# Altium schematic sheet NPNTransistorArray.SchDoc
size A3
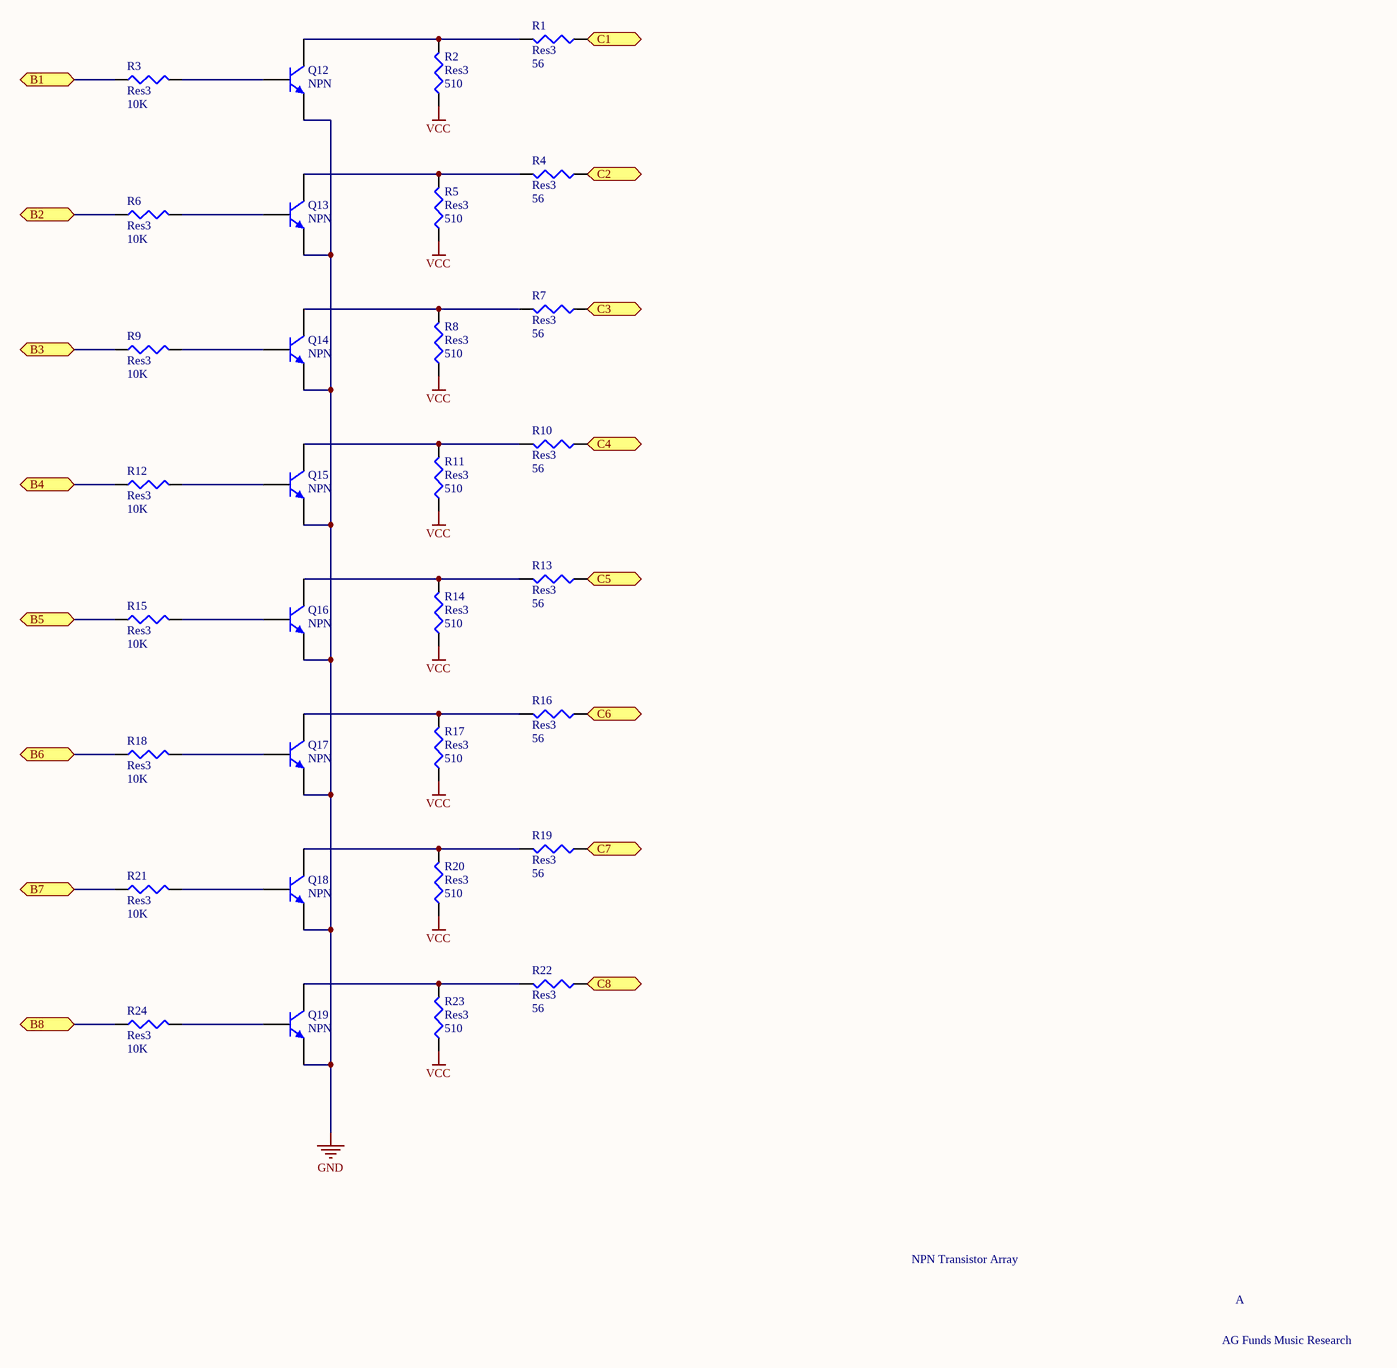
[diagram p0: NPNTransistorArray.SchDoc]

## Parts
Q12  NPN  [SOT95P230-3N]
Q13  NPN  [SOT95P230-3N]
Q14  NPN  [SOT95P230-3N]
Q15  NPN  [SOT95P230-3N]
Q16  NPN  [SOT95P230-3N]
Q17  NPN  [SOT95P230-3N]
Q18  NPN  [SOT95P230-3N]
Q19  NPN  [SOT95P230-3N]
R1  Res3  value 56  [J1-0603]
R2  Res3  value 510  [J1-0603]
R3  Res3  value 10K  [J1-0603]
R4  Res3  value 56  [J1-0603]
R5  Res3  value 510  [J1-0603]
R6  Res3  value 10K  [J1-0603]
R7  Res3  value 56  [J1-0603]
R8  Res3  value 510  [J1-0603]
R9  Res3  value 10K  [J1-0603]
R10  Res3  value 56  [J1-0603]
R11  Res3  value 510  [J1-0603]
R12  Res3  value 10K  [J1-0603]
R13  Res3  value 56  [J1-0603]
R14  Res3  value 510  [J1-0603]
R15  Res3  value 10K  [J1-0603]
R16  Res3  value 56  [J1-0603]
R17  Res3  value 510  [J1-0603]
R18  Res3  value 10K  [J1-0603]
R19  Res3  value 56  [J1-0603]
R20  Res3  value 510  [J1-0603]
R21  Res3  value 10K  [J1-0603]
R22  Res3  value 56  [J1-0603]
R23  Res3  value 510  [J1-0603]
R24  Res3  value 10K  [J1-0603]

## Ports
B1, B2, B3, B4, B5, B6, B7, B8, C1, C2, C3, C4, C5, C6, C7, C8

## Nets
GND: Q12.3(E) Q13.3(E) Q14.3(E) Q15.3(E) Q16.3(E) Q17.3(E) Q18.3(E) Q19.3(E)
VCC: R2.1 R5.1 R8.1 R11.1 R14.1 R17.1 R20.1 R23.1
B1: R3.1 ; port B1
B2: R6.1 ; port B2
B3: R9.1 ; port B3
B4: R12.1 ; port B4
B5: R15.1 ; port B5
B6: R18.1 ; port B6
B7: R21.1 ; port B7
B8: R24.1 ; port B8
C1: R1.1 ; port C1
C2: R4.1 ; port C2
C3: R7.1 ; port C3
C4: R10.1 ; port C4
C5: R13.1 ; port C5
C6: R16.1 ; port C6
C7: R19.1 ; port C7
C8: R22.1 ; port C8
NetQ12_1: Q12.1(C) R1.2 R2.2
NetQ12_2: Q12.2(B) R3.2
NetQ13_1: Q13.1(C) R4.2 R5.2
NetQ13_2: Q13.2(B) R6.2
NetQ14_1: Q14.1(C) R7.2 R8.2
NetQ14_2: Q14.2(B) R9.2
NetQ15_1: Q15.1(C) R10.2 R11.2
NetQ15_2: Q15.2(B) R12.2
NetQ16_1: Q16.1(C) R13.2 R14.2
NetQ16_2: Q16.2(B) R15.2
NetQ17_1: Q17.1(C) R16.2 R17.2
NetQ17_2: Q17.2(B) R18.2
NetQ18_1: Q18.1(C) R19.2 R20.2
NetQ18_2: Q18.2(B) R21.2
NetQ19_1: Q19.1(C) R22.2 R23.2
NetQ19_2: Q19.2(B) R24.2

## Notes on the sheet
- NPN Transistor Array
- A
- AG Funds Music Research

## Library data of the parts
Q12-Q19 = NPN: BC817/BC818 SMD NPN Bipolar Transistor; Published: 8-Jun-2000; LatestRevisionDate: 17-Jul-2002; LatestRevisionNote: Re-released for DXP Platform.; PackageReference: TO-226-AA; Publisher: Altium Limited; PackageDescription: TO, Flat Index; 3 In-Line, Axial Leads; Body Dia. 4.8mm; Leads 0.55 x 0.51 mm (max); Code_JEDEC: TO-226-AA
R1-R24 = Res3: Resistor; Published: 8-Jun-2000; LatestRevisionDate: 29-May-2009; LatestRevisionNote: IPC-7351 Footprint Added.; PackageReference: J1-0603; Publisher: Altium Limited; PackageDescription: Chip Resistor